# Altium schematic sheet SMART_FARM.SchDoc
size A; SheetNumber: 1; SheetTotal: 1
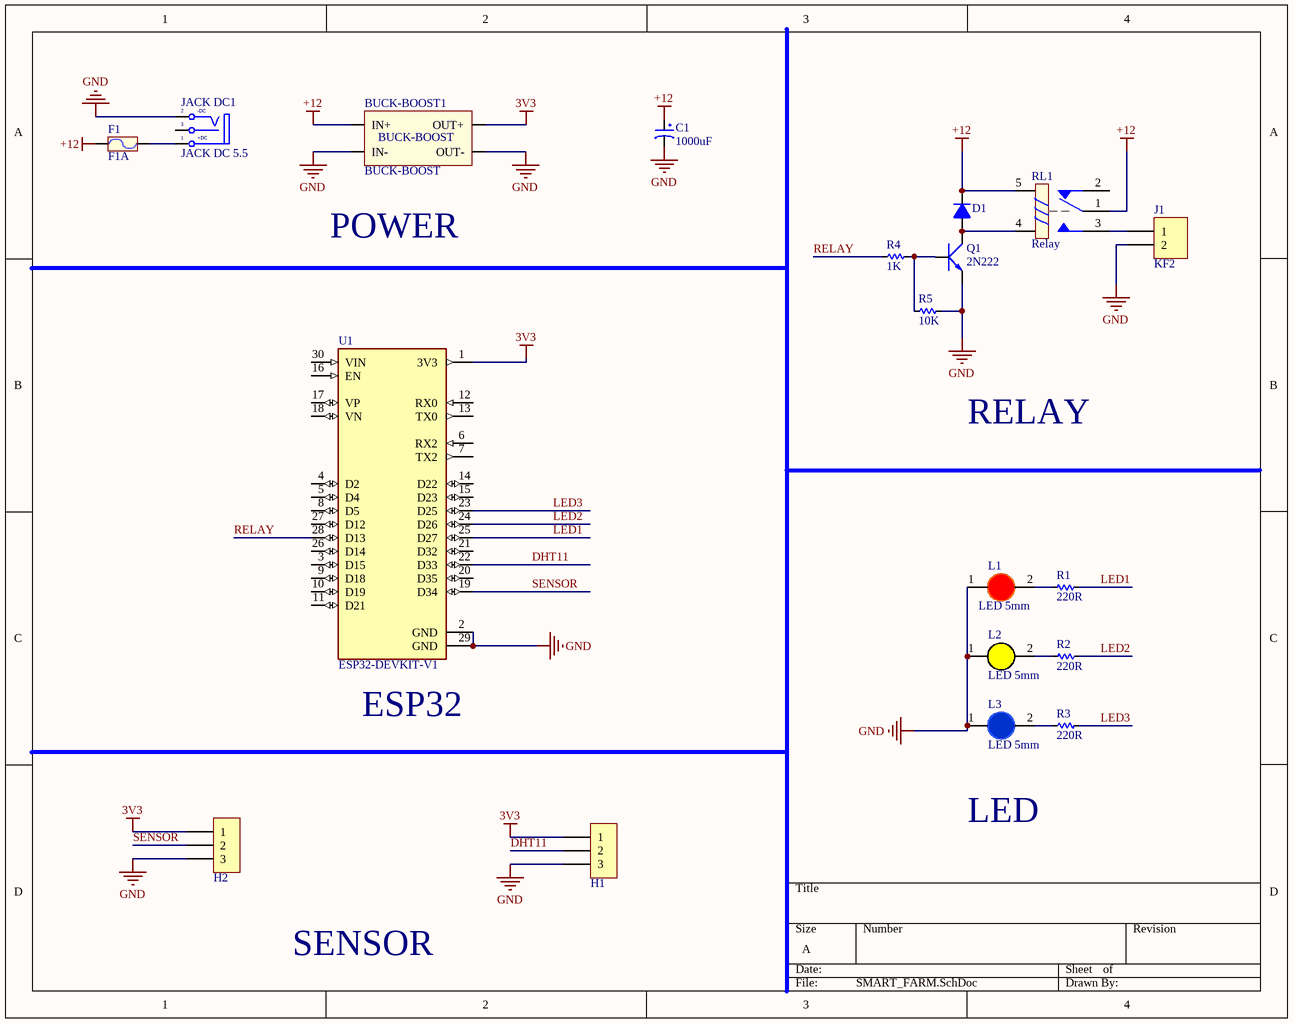
[diagram p0: SMART_FARM.SchDoc]

## Parts
BUCK-BOOST1  BUCK-BOOST  [BUCK3A]
C1  1000uF  [tu hoa 13mm]
D1  100v  [DIODE 1A]  (value not drawn)
F1  F1A  [FUSE2]
H1  Header 3P 2.54 Duc Thang  [XH2.54M-3]  (value not drawn)
H2  Header 3P 2.54 Duc Thang  [XH2.54M-3]  (value not drawn)
J1  KF2  [KF2-5.08]
JACK_DC1  JACK DC 5.5  [JACK DC 5.5]
L1  LED 5mm  [LED-5MM-RED]
L2  LED 5mm  [LED-5MM-Yellow]
L3  LED 5mm  [LED-5MM-BLUE]
Q1  2N222  [TO92-123]
R1  220R  [RES-1/4W]
R2  220R  [RES-1/4W]
R3  220R  [RES-1/4W]
R4  1K  [RES-1/4W]
R5  10K  [RES-1/4W]
RL1  Relay  [Relay 5 Chan SRD]
U1  ESP32-DEVKIT-V1  [MODULE_ESP32_DEVKIT_V1]

## Nets
3V3: BUCK-BOOST1.4(OUT+) H1.1 H2.1 U1.1(3V3)
+12: BUCK-BOOST1.1(IN+) C1.1 D1.2(K) F1.1 RL1.1 RL1.5
GND: BUCK-BOOST1.2(IN-) BUCK-BOOST1.3(OUT-) C1.2 H1.3 H2.3 J1.2 JACK_DC1.2(TN) L1.1(A) L2.1(A) L3.1(A) Q1.1(E) R5.1 U1.2(GND) U1.29(GND)
DHT11: H1.2 U1.22(D33)
LED1: R1.1 U1.25(D27)
LED2: R2.1 U1.24(D26)
LED3: R3.1 U1.23(D25)
RELAY: R4.2 U1.28(D13)
SENSOR: H2.2 U1.19(D34)
NetD1_1: D1.1(A) Q1.3(C) RL1.4
NetF1_2: F1.2 JACK_DC1.1(T)
NetJ1_1: J1.1 RL1.3
NetL1_2: L1.2(K) R1.2
NetL2_2: L2.2(K) R2.2
NetL3_2: L3.2(K) R3.2
NetQ1_2: Q1.2(B) R4.1 R5.2

Not connected (* = marked no-connect by the designer): JACK_DC1 3(S); RL1 2; U1 3(D15) 4(D2) 5(D4) 6(RX2) 7(TX2) 8(D5) 9(D18) 10(D19) 11(D21) 12(RX0) 13(TX0) 14(D22) 15(D23) 16(EN) 17(VP) 18(VN) 20(D35) 21(D32) 26(D14) 27(D12) 30(VIN)

## Notes on the sheet
- POWER
- RELAY
- (near U1) ESP32
- LED
- SENSOR
- (in symbol JACK DC 5.5) -DC; +DC

## Library data of the parts
BUCK-BOOST1 = BUCK-BOOST: Value: Header 4
C1 = Tu Hoa 1000uF 25V 13x21: Cắm; Don_Vi: Con; So_Chan: 2; Ten_Linh_Kien: Tụ Hóa 1000uF 25V 13x21MM; Ma_Hang: MH002315; Chung_Loai: Cắm; Kieu_Chan: *
D1 = Diode 1N4007: Cắm; Ten_Linh_Kien: Diode 1N4007 1A (DIP); Don_Vi: Con; Ma_Hang: MH001063; Ghi Chu: *; Kieu_Chan: *; Chung_Loai: Cắm
F1 = Fuse: Designed by: VanDungEvn; Value: Fuse
H1 H2 = Header 3P 2.54 Duc Thang: Cắm; Ten_Linh_Kien: Header 3P XH2.54-3P Đực Thẳng; Don_Vi: Con; Ma_Hang: MH001292; Chung_Loai: Cắm
J1 = KF2: Manufacturer: Würth Elektronik eiSos GmbH; partNo: 691103110002; ComponentLink1 Description: Manufacturer; ComponentLink2 Description: Datasheet; NoPins: 2; Created Date: 29 October 2013; ComponentLink1URL: http://www.we-online.com; ComponentLink2URL: http://katalog.we-online.de/em/datasheet/6911031100xx.pdf; Created by: Karrer Zheng
JACK_DC1 = JACK DC 5.5: Value: Jac DC
L1 = LED 5mm Do: Cắm; Don_Vi: Con; Ma_Hang: MH008967; Ten_Linh_Kien: Led 5MM Phủ Đỏ (1000c); Ghi_Chu: *; Kieu_Chan: *; Chung_Loai: Cắm
L2 = LED 5mm Vang: Cắm; Don_Vi: Con; Ma_Hang: MH008968; Ten_Linh_Kien: Led 5MM Phủ Vàng (1000c); Ghi_Chu: *; Kieu_Chan: *; Chung_Loai: Cắm
L3 = LED 5mm Xanh Duong: Cắm; Don_Vi: Con; Ma_Hang: MH008987; Ten_Linh_Kien: Led 5MM Xanh Dương Đục (1000c); Ghi_Chu: *; Kieu_Chan: *; Chung_Loai: Cắm
Q1 = 2N222: NPN 600mW, ECB; Value: C1815
R1-R5 = Res: Manufacturer: Generic Components; Class: Passive; SubClass: R; Published: 08/06/2000; Publisher: Altium Hobart Technology Centre
RL1 = Relay 5 Chan SRD: Relay 5 Chan; Ma_Hang: MH009374; Ten: Relay 5V10A SRD-05VDC-SL-C Chính Hãng
U1 = ESP32-DEVKIT-V1: Dual core, Wi-Fi: 2.4 GHz up to 150 Mbits/s,BLE (Bluetooth Low Energy) and legacy Bluetooth, 32 bits, Up to 240 MHz; MF: Do it; Price: None; Availability: Not in stock; Package: None; MP: ESP32-DEVKIT-V1; Value: *; SnapEDA_Link: https://www.snapeda.com/parts/ESP32-DEVKIT-V1/Do+it/view-part/?ref=snap; Check_prices: https://www.snapeda.com/parts/ESP32-DEVKIT-V1/Do+it/view-part/?ref=eda